# EAGLE schematic module-test (EAGLE 5.11)
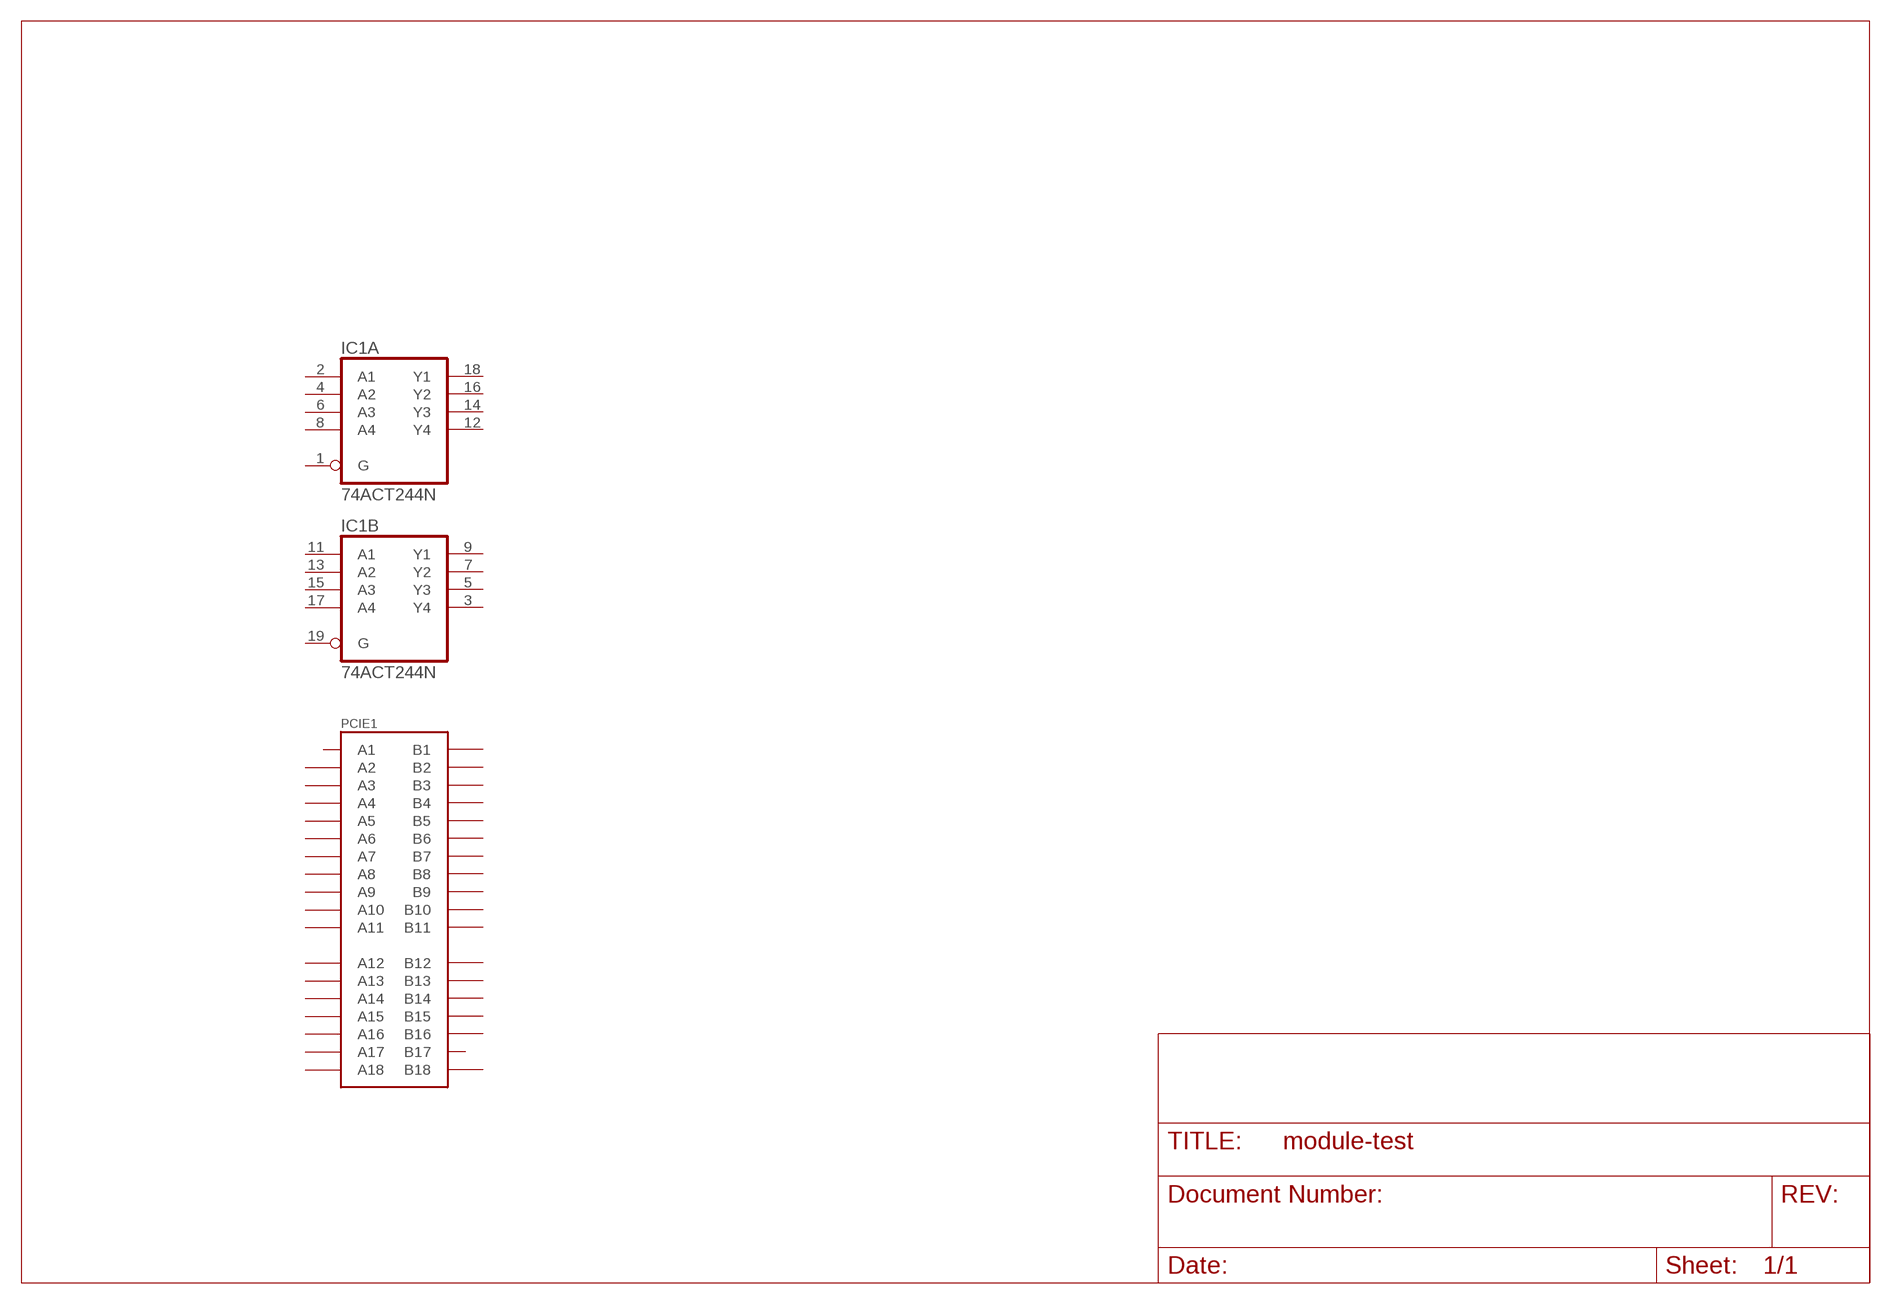
[diagram p0: schematic, sheet 1]

## Parts
IC1  74ACT244N  [DIL20]
PCIE1  PCIE-36-EDGE  [PCIE-36-EDGE]
Unconnected: IC1.1(A:G) IC1.2(A:A1) IC1.3(B:Y4) IC1.4(A:A2) IC1.5(B:Y3) IC1.6(A:A3) IC1.7(B:Y2) IC1.8(A:A4) IC1.9(B:Y1) IC1.11(B:A1) IC1.12(A:Y4) IC1.13(B:A2) IC1.14(A:Y3) IC1.15(B:A3) IC1.16(A:Y2) IC1.17(B:A4) IC1.18(A:Y1) IC1.19(B:G) PCIE1.A1 PCIE1.A2 PCIE1.A3 PCIE1.A4 PCIE1.A5 PCIE1.A6 PCIE1.A7 PCIE1.A8 PCIE1.A9 PCIE1.A10 PCIE1.A11 PCIE1.A12 PCIE1.A13 PCIE1.A14 PCIE1.A15 PCIE1.A16 PCIE1.A17 PCIE1.A18 PCIE1.B1 PCIE1.B2 PCIE1.B3 PCIE1.B4 PCIE1.B5 PCIE1.B6 PCIE1.B7 PCIE1.B8 PCIE1.B9 PCIE1.B10 PCIE1.B11 PCIE1.B12 PCIE1.B13 PCIE1.B14 PCIE1.B15 PCIE1.B16 PCIE1.B17 PCIE1.B18

## Power pins joined to a net without a drawn wire
GND: IC1.10(P:GND)
VCC: IC1.20(P:VCC)

## Library data of the parts
IC1 = 74xx-eu:74*244: Octal BUFFER and LINE DRIVER, 3-state
PCIE1 = jt-con-pcie:PCIE-36-*: PCI-E 36-way connectors